# EAGLE design probeStationBoardPcbWay (EAGLE 9.1.0)
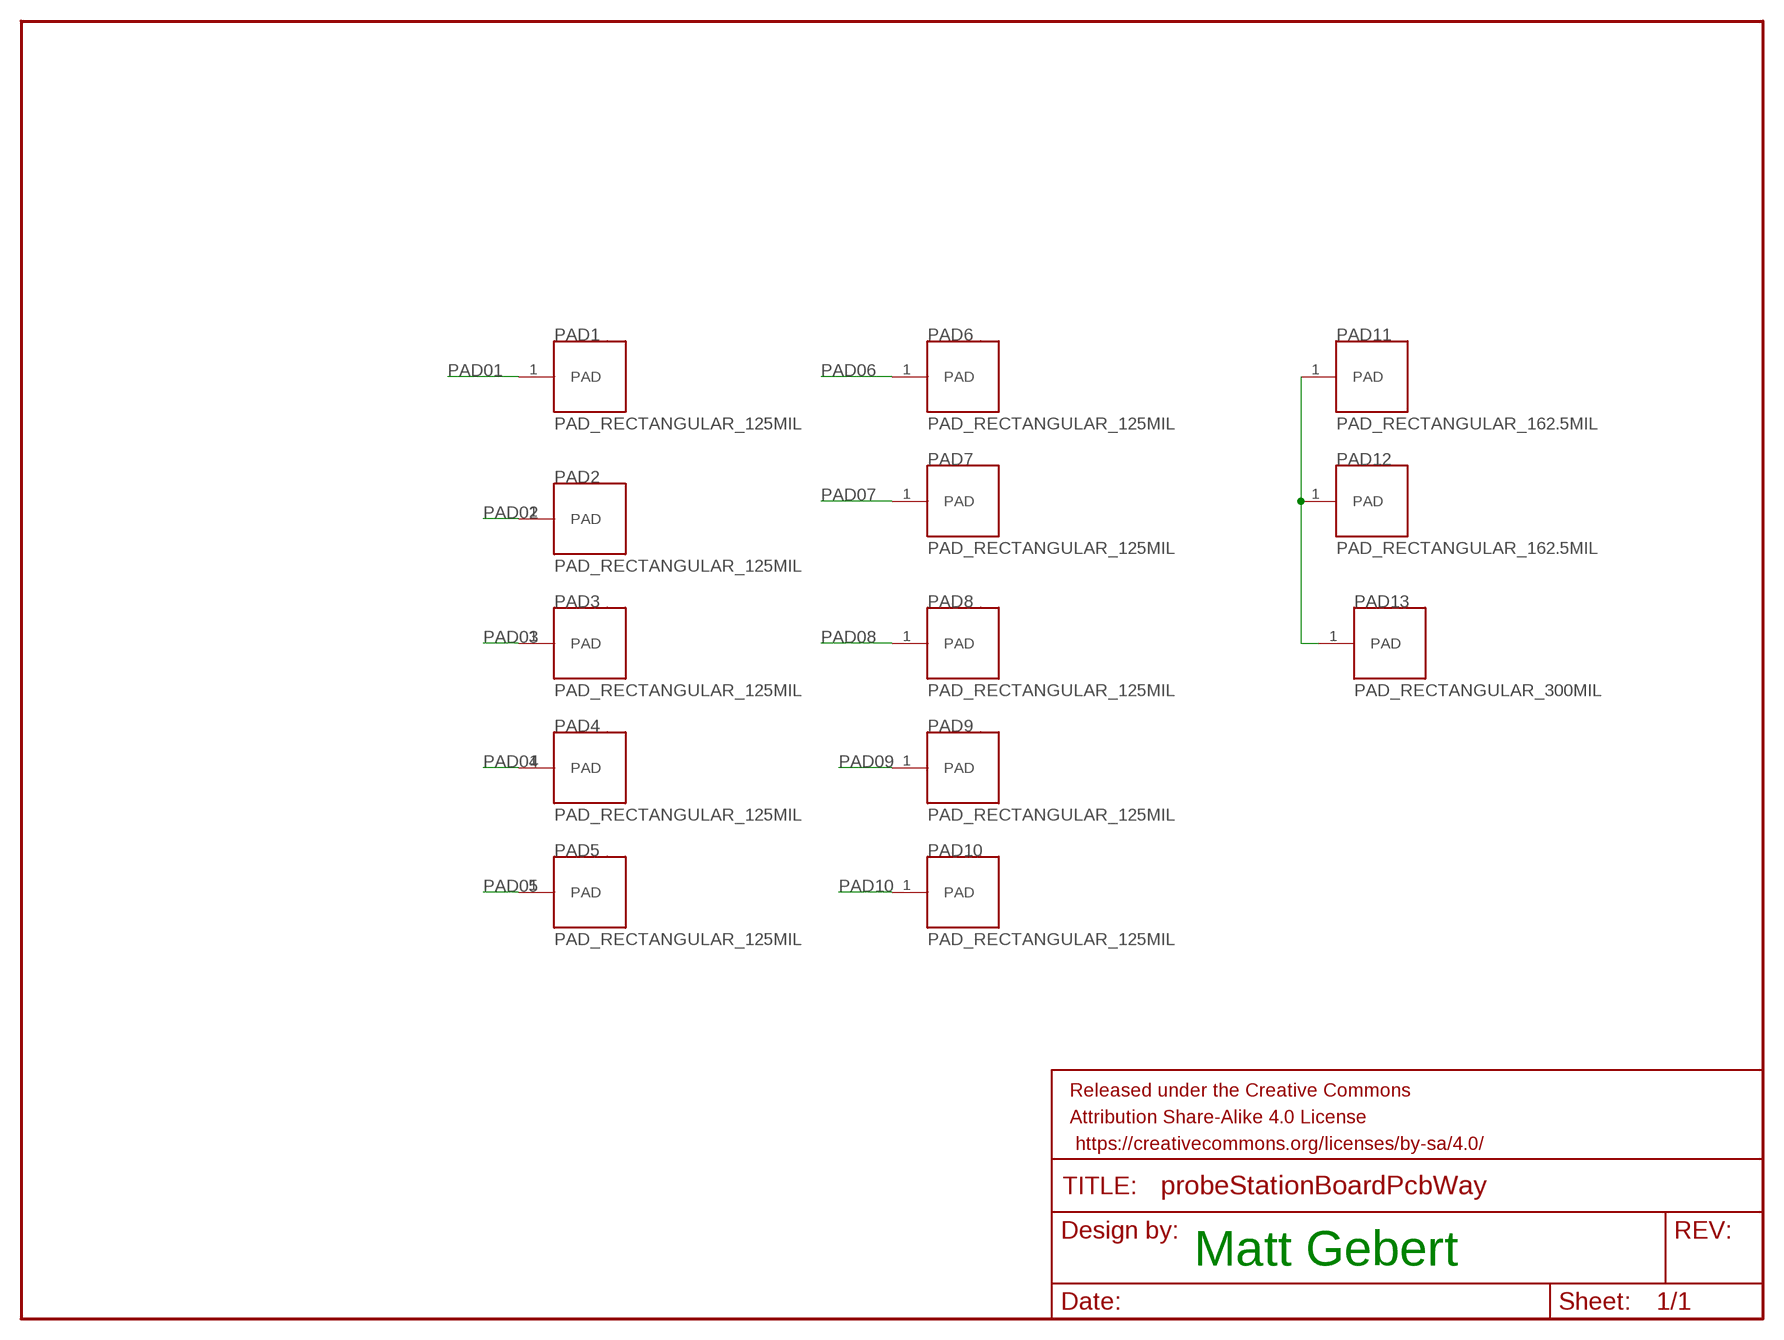
[diagram p0: schematic, sheet 1]

## Parts
FRAME1  FRAME-LETTERNO_PACKAGE  [DUMMY]
PAD1  PAD_RECTANGULAR_125MIL  [125MIL]
PAD2  PAD_RECTANGULAR_125MIL  [125MIL]
PAD3  PAD_RECTANGULAR_125MIL  [125MIL]
PAD4  PAD_RECTANGULAR_125MIL  [125MIL]
PAD5  PAD_RECTANGULAR_125MIL  [125MIL]
PAD6  PAD_RECTANGULAR_125MIL  [125MIL]
PAD7  PAD_RECTANGULAR_125MIL  [125MIL]
PAD8  PAD_RECTANGULAR_125MIL  [125MIL]
PAD9  PAD_RECTANGULAR_125MIL  [125MIL]
PAD10  PAD_RECTANGULAR_125MIL  [125MIL]
PAD11  PAD_RECTANGULAR_162.5MIL  [162.5MIL]
PAD12  PAD_RECTANGULAR_162.5MIL  [162.5MIL]
PAD13  PAD_RECTANGULAR_300MIL  [300MIL]

## Nets
GATE: PAD11.1(PAD) PAD12.1(PAD) PAD13.1(PAD)
PAD01: PAD1.1(PAD)
PAD02: PAD2.1(PAD)
PAD03: PAD3.1(PAD)
PAD04: PAD4.1(PAD)
PAD05: PAD5.1(PAD)
PAD06: PAD6.1(PAD)
PAD07: PAD7.1(PAD)
PAD08: PAD8.1(PAD)
PAD09: PAD9.1(PAD)
PAD10: PAD10.1(PAD)

## Notes on the sheet
- Matt Gebert

## Library data of the parts
FRAME1 = SparkFun-Aesthetics:FRAME-LETTER: Schematic Frame - Letter Standard 8.5x11 US Letter frame; DESIGNER: Nobody; VERSION: v01
PAD1-PAD10 = Probe_Station_Pads:PAD_RECTANGULAR_125MIL
PAD11 PAD12 = Probe_Station_Pads:PAD_RECTANGULAR_162.5MIL
PAD13 = Probe_Station_Pads:PAD_RECTANGULAR_300MIL

## Board
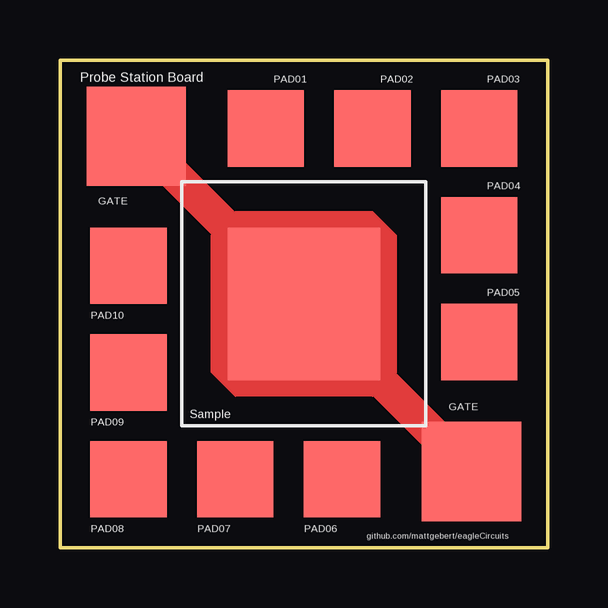
[diagram p1: board, top side]
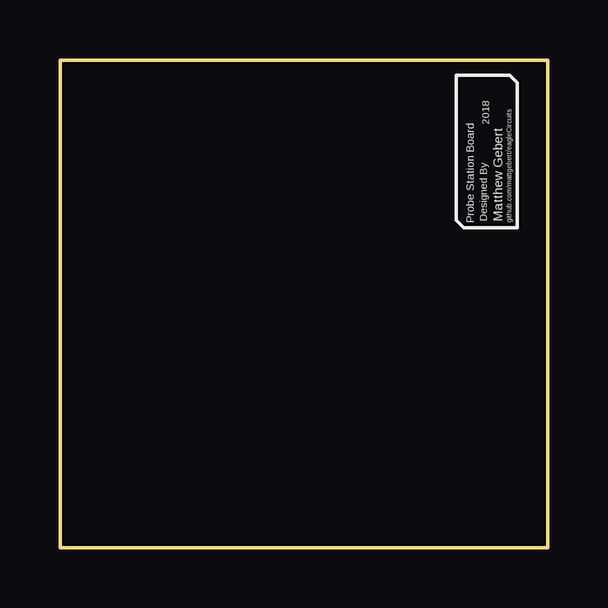
[diagram p2: board, bottom side, seen from below]

Size 20.32 x 20.32 mm. Coordinates in mm from the lower left corner, seen from the top.
Outline: 0,0 20.31,0 20.31,20.31 0,20.31 0,0
Outline: 0,0 0,20.32 20.32,20.32 20.32,0 0,0
Copper layers (1*16): Top 0.035mm / dielectric 1.5mm / Bottom 0.035mm
Design rules "SparkFun": minimum track width 8mil, minimum drill 20mil, track to track 8mil, track to pad 8mil, pad to pad 8mil, via to via 8mil, smd to smd 8mil, copper to edge 8mil, drill to drill 8mil, minimum pad ring 12mil, minimum via ring 10mil, stop-mask expansion 4mil, vias tented up to drill 20mil, thermal gap 10mil

### Footprints (pad centres in the part's own frame; a part is rotated, then mirrored left to right if it is on the bottom)
125MIL = smd 3.175 x 3.175: 1 0,0
162.5MIL = smd 4.128 x 4.128: 1 0,0
300MIL = smd 6.35 x 6.35: 1 0,0

### Placement (x,y rotation side)
FRAME1  -13.97,1.27 0 top  (outside the outline)
PAD1  8.57,17.46 0 top
PAD2  13.02,17.46 0 top
PAD3  17.46,17.46 0 top
PAD4  17.46,13.02 0 top
PAD5  17.46,8.57 0 top
PAD6  11.75,2.86 0 top
PAD7  7.3,2.86 0 top
PAD8  2.86,2.86 0 top
PAD9  2.86,7.3 0 top
PAD10  2.86,11.75 0 top
PAD11  17.14,3.17 0 top
PAD12  3.17,17.14 0 top
PAD13  10.16,10.16 0 top

### Tracks (layer width: path | path; a pad name or v marks a point on that pad's centre or on a via)
GATE
  Top 1.346: PAD12.1 PAD13.1 PAD11.1

### Text on the board
tPlace: Probe Station Board | PAD01 | PAD02 | PAD03 | PAD04 | GATE | PAD10 | PAD05 | GATE | PAD09 | Sample | PAD08 | PAD07 | PAD06 | github.com/mattgebert/eagleCircuits
bPlace: 2018 | github.com/mattgebert/eagleCircuits | Matthew Gebert | Designed By | Probe Station Board